# EAGLE design v0.4.4 (EAGLE 7.1.0)
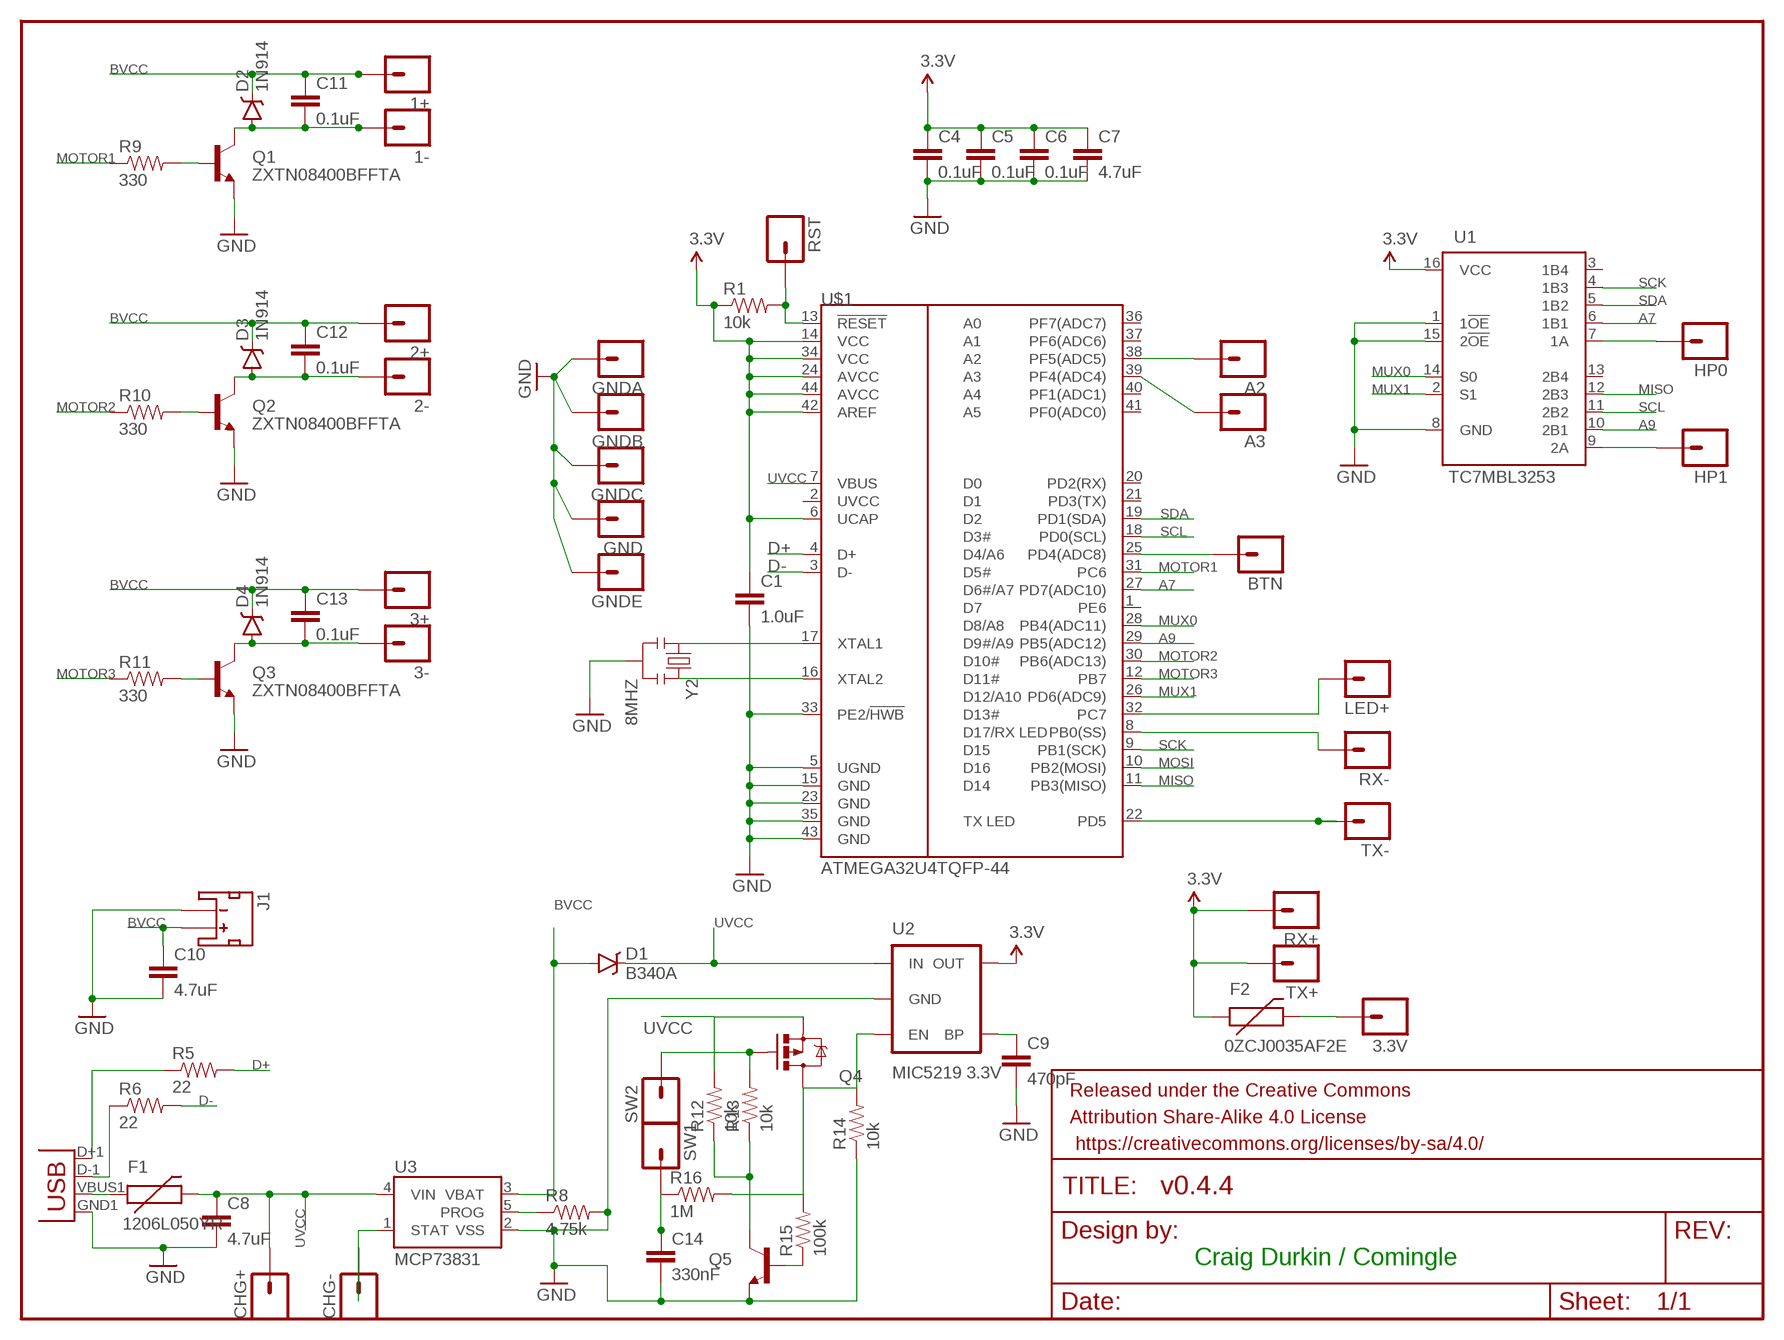
[diagram p0: schematic, sheet 1]

## Parts
1+  M01PTH  [1X01]
1-  M01PTH  [1X01]
2+  M01PTH  [1X01]
2-  M01PTH  [1X01]
3+  M01PTH  [1X01]
3-  M01PTH  [1X01]
3.3V  M01PTH  [1X01]
A2  M01PTH  [1X01]
A3  M01PTH  [1X01]
BTN  M01PTH  [1X01]
C1  1.0uF  CAP0603-CAP  [0603-CAP]
C4  0.1uF  CAP0603-CAP  [0603-CAP]
C5  0.1uF  CAP0603-CAP  [0603-CAP]
C6  0.1uF  CAP0603-CAP  [0603-CAP]
C7  4.7uF  CAP0603-CAP  [0603-CAP]
C8  4.7uF  CAP1206  [1206]
C9  470pF  CAP0603-CAP  [0603-CAP]
C10  4.7uF  CAP1206  [1206]
C11  0.1uF  CAP0603-CAP  [0603-CAP]
C12  0.1uF  CAP0603-CAP  [0603-CAP]
C13  0.1uF  CAP0603-CAP  [0603-CAP]
C14  330nF  CAP0603-CAP  [0603-CAP]
CHG+  M01PTH  [1X01]
CHG-  M01PTH  [1X01]
D1  B340A  DIODE-SCHOTTKY-B340A  [SMA-DIODE]
D2  1N914  BAT20JFILM  [SOD-323]
D3  1N914  BAT20JFILM  [SOD-323]
D4  1N914  BAT20JFILM  [SOD-323]
F1  1206L050YR  PTCSMD  [PTC-1206]
F2  0ZCJ0035AF2E  PTCSMD  [PTC-1206]
FRAME1  FRAME-LETTER  [CREATIVE_COMMONS]
GND  M01PTH  [1X01]
GNDA  M01PTH  [1X01]
GNDB  M01PTH  [1X01]
GNDC  M01PTH  [1X01]
GNDE  M01PTH  [1X01]
HP0  M01PTH  [1X01]
HP1  M01PTH  [1X01]
J1  JST_2MM_MALE  [JST-2-SMD]
JP4  USB  [USB-B-MICRO-SMD_V03]
LED+  M01PTH  [1X01]
Q1  ZXTN08400BFFTA  TRANSISTOR_NPNSOT23-3  [SOT23-3]
Q2  ZXTN08400BFFTA  TRANSISTOR_NPNSOT23-3  [SOT23-3]
Q3  ZXTN08400BFFTA  TRANSISTOR_NPNSOT23-3  [SOT23-3]
Q4  NTS2101PT1G  MOSFET-PCHANNEL  [SOT23-3]
Q5  MMBT2222A  TRANSISTOR_NPNMMBT2222A  [SOT23-3]
R1  10k  RESISTOR0603-RES  [0603-RES]
R5  22  RESISTOR0603-RES  [0603-RES]
R6  22  RESISTOR0603-RES  [0603-RES]
R8  4.75k  RESISTOR0603-RES  [0603-RES]
R9  330  RESISTOR0603-RES  [0603-RES]
R10  330  RESISTOR0603-RES  [0603-RES]
R11  330  RESISTOR0603-RES  [0603-RES]
R12  10k  RESISTOR0603-RES  [0603-RES]
R13  10k  RESISTOR0603-RES  [0603-RES]
R14  10k  RESISTOR0603-RES  [0603-RES]
R15  100k  RESISTOR0603-RES  [0603-RES]
R16  1M  RESISTOR0603-RES  [0603-RES]
RST  M01PTH  [1X01]
RX+  M01PTH  [1X01]
RX-  M01PTH  [1X01]
SW1  M01PTH  [1X01]
SW2  M01PTH  [1X01]
TX+  M01PTH  [1X01]
TX-  M01PTH  [1X01]
U1  TC7MBL3253  [SSOP16-PRACTICE]
U2  MIC5219 3.3V  V_REG_MIC52193.3V  [SOT23-5]
U3  MCP73831  [SOT23-5]
U$1  ATMEGA32U4TQFP-44  [TQFP44]
Y2  8MHZ  RESONATOR8MHZ  [RESONATOR-SMD]

## Nets
A7: U1.6(1B1) U$1.27(PD7(ADC10))
A9: U1.10(2B1) U$1.29(PB5(ADC12))
BVCC: 1+.1 2+.1 3+.1 C10.1 C11.1 C12.1 C13.1 D1.A D2.C D3.C D4.C J1.2(+) U3.3(VBAT)
D+: R5.2 U$1.4(D+)
D-: R6.2 U$1.3(D-)
GNDD: C1.2 C4.2 C5.2 C6.2 C7.2 C8.2 C9.2 C10.2 C14.2 GND.1 GNDA.1 GNDB.1 GNDC.1 GNDE.1 J1.1(-) JP4.GND1(GND) Q1.2(E) Q2.2(E) Q3.2(E) Q5.2(E) R8.2 R14.1 U1.1(1!OE) U1.8(GND) U1.15(2!OE) U2.2(GND) U3.2(VSS) U$1.5(UGND) U$1.15(GND) U$1.23(GND) U$1.33(PE2/!HWB) U$1.35(GND) U$1.43(GND) Y2.2 ; supply symbol labelled GND
MISO: U1.12(2B3) U$1.11(PB3(MISO))
MOSI: U$1.10(PB2(MOSI))
MOTOR1: R9.1 U$1.31(PC6)
MOTOR2: R10.1 U$1.30(PB6(ADC13))
MOTOR3: R11.1 U$1.12(PB7)
MUX0: U1.14(S0) U$1.28(PB4(ADC11))
MUX1: U1.2(S1) U$1.26(PD6(ADC9))
N$1: U$1.17(XTAL1) Y2.1
N$2: R8.1 U3.5(PROG)
N$3: Q4.3(D) R14.2 R15.2 R16.2 U2.3(EN)
N$4: F1.1 JP4.VBUS1(VBUS)
N$5: 3.3V.1 F2.2
N$6: U$1.16(XTAL2) Y2.3
N$7: LED+.1 U$1.32(PC7)
N$8: RX-.1 U$1.8(PB0(SS))
N$9: TX-.1 U$1.22(PD5)
N$10: JP4.D+1(D+) R5.1
N$11: JP4.D-1(D-) R6.1
N$13: HP1.1 U1.9(2A)
N$14: HP0.1 U1.7(1A)
N$15: A2.1 U$1.38(PF5(ADC5))
N$16: A3.1 U$1.39(PF4(ADC4))
N$17: BTN.1 U$1.25(PD4(ADC8))
N$19: CHG-.1 U3.1(STAT)
N$20: Q5.3(C) R12.1 R13.1
N$21: C14.1 R16.1 SW1.1
N$22: C9.1 U2.4(BP)
N$23: Q4.1(G) R13.2 SW2.1
N$24: 1-.1 C11.2 D2.A Q1.3(C)
N$25: 2-.1 C12.2 D3.A Q2.3(C)
N$26: 3-.1 C13.2 D4.A Q3.3(C)
N$27: Q1.1(B) R9.2
N$28: Q2.1(B) R10.2
N$29: Q3.1(B) R11.2
N$30: Q5.1(B) R15.1
RST: R1.2 RST.1 U$1.13(!RESET)
SCK: U1.4(1B3) U$1.9(PB1(SCK))
SCL: U1.11(2B2) U$1.18(PD0(SCL))
SDA: U1.5(1B2) U$1.19(PD1(SDA))
UVCC: C8.1 CHG+.1 D1.C F1.2 Q4.2(S) R12.2 U2.1(IN) U3.4(VIN) U$1.7(VBUS)
VCC: C1.1 C4.1 C5.1 C6.1 C7.1 F2.1 R1.1 RX+.1 TX+.1 U1.16(VCC) U2.5(OUT) U$1.6(UCAP) U$1.14(VCC) U$1.24(AVCC) U$1.34(VCC) U$1.42(AREF) U$1.44(AVCC) ; supply symbol labelled 3.3V
Unconnected: J1.NC1(PAD1) J1.NC2(PAD2) U1.3(1B4) U1.13(2B4) U$1.1(PE6) U$1.2(UVCC) U$1.20(PD2(RX)) U$1.21(PD3(TX)) U$1.36(PF7(ADC7)) U$1.37(PF6(ADC6)) U$1.40(PF1(ADC1)) U$1.41(PF0(ADC0))

## Notes on the sheet
- Craig Durkin / Comingle

## Library data of the parts
1+ 1- 2+ 2- 3+ 3- 3.3V A2 A3 BTN CHG+ CHG- GND GNDA GNDB GNDC GNDE HP0 HP1 LED+ RST RX+ RX- SW1 SW2 TX+ TX- = SparkFun-Connectors:M01: Header 1 Standard 1-pin 0.1" header. Use with straight break away headers (SKU : PRT-00116), right angle break away headers (PRT-00553), swiss pins (PRT-00743), machine pins (PRT-00117), and female headers (PRT-00115).
C1 C9 C11-C14 = SparkFun-Capacitors:CAP: Capacitor Standard 0603 ceramic capacitor, and 0.1" leaded capacitor.
C4-C8 C10 = SparkFun-Passives:CAP: Capacitor Standard 0603 ceramic capacitor, and 0.1" leaded capacitor.
D1 = SparkFun-DiscreteSemi:DIODE-SCHOTTKY: Schottky diodes in SFE's production catalog BAT20J 1A 23V 0.62Vf RB751 120mA 40V 0.37Vf PMEG4005EJ 0.5A 40V 0.42Vf MBRA140 1A 40V 0.5Vf B340A 3A 40V SMA; PROD_ID: DIO-09886
D2-D4 = SparkFun-DiscreteSemi:BAT20JFILM: 23V, 1A Schottky diode, SOD-323 package; PROD_ID: DIO-11623; VALUE: BAT20JFILM
F1 F2 = SparkFun-PowerIC:PTC: Resettable Fuse PTC Resettable Fuse. Spark Fun Electronics SKU : COM-08357; PROD_ID: RES-11150
FRAME1 = SparkFun-Aesthetics:FRAME-LETTER: Schematic Frame Standard 8.5x11 US Letter frame
J1 = SparkFun-Connectors:JST_2MM_MALE: Mates to single-cell LiPo batteries. CONN-08352; PROD_ID: CONN-08352
JP4 = SparkFun-Connectors:USB: USB Connectors USB-B-PTH is fully proven SKU : PRT-00139/CONN-08278 USB-miniB is fully proven SKU : PRT-00587 USB-A-PCB is untested. USB-A-H is throughly reviewed, but untested. Spark Fun Electronics SKU : PRT-00437 USB-B-SMT is throughly reviewed, but untested. Needs silkscreen touching up. USB-A-S has not been used/tested USB-MB-H has not been used/tested USB-MICROB has been used. CONN-09505
Q1-Q3 Q5 = SparkFun-DiscreteSemi:TRANSISTOR_NPN: Generic NPN BJT MMBT2222A - TRANS-08049 (SOT-23, 1A 40V) MPSA42 - TRANS-09116 (SOT-23, 500mA 300V) MMBT5088LT1G - TRANS-11160 (SOT-23, 50 mA 30V) BC547 - COM-08928 <http://www.sparkfun.com/products/8928> (TO-92 45V 100mA) (1.Collector 2.Base 3.Emitter) 2N3904 - COM-00521 <http://www.sparkfun.com/products/521> (TO-92 40V 200mA) (1.Emitter 2.Base 3.Collector) P2N2222A - COM-12852 <http://www.sparkfun.com/products/12852> (TO-92 40V 600mA) (1.Collector 2.Base 3.Emitter); PROD_ID: TRANS-08049
Q4 = SparkFun-DiscreteSemi:MOSFET-PCHANNEL: Generic PMOSFET IRLML2244 - TRANS-11153 (SOT-23 -20V -4.3A) (1.Gate 2.Source 3.Drain) FQP27P06 - COM-10349 <http://www.sparkfun.com/products/10349> (TO-220 -60V -27A) (1.Gate 2.Source 3.Drain); PROD_ID: TRANS-08285
R1 R5 R6 R8-R16 = SparkFun-Passives:RESISTOR: Resistor Basic schematic elements and footprints for 0603, 1206, and PTH resistors.
U1 = SparkFun-DigitalIC:TC7MBL3253: 74CBT 2 x 4:1 multiplexer. 1OE and 2OE are output enable pins, and S0 and S1 determine which ouptut (xB4, xB3, ...) is connected to the xA
U2 = SparkFun-PowerIC:V_REG_MIC5219: V_REG MIC5219 Standard 3.3V and 5V 500mA LDO voltage regulator in SOT-23 layout. Micrel part MIC5219. BP (by-pass) pin is used to lower output noise with 470pF cap, may be left open.; PROD_ID: VREG-09872
U3 = SparkFun-PowerIC:MCP73831: Miniature single cell, fully integrated Li-Ion, Li-polymer charge management controller http://ww1.microchip.com/downloads/en/DeviceDoc/21984a.pdf IC-09995; PROD_ID: IC-09995
U$1 = SparkFun-DigitalIC:ATMEGA32U4: Atmel 44-pin 8-bit Microcontroller with 32KBytes of ISP Flash and USB Controller
Y2 = SparkFun-FreqCtrl:RESONATOR: Resonator Small SMD resonator. Used, eg, on the Arduino Pro/ Pro Mini boards. 8MHz- XTAL-08895 16MHz- XTAL-08900; PROD_ID: XTAL-08895

## Net classes
0 default: width 0.254 mm, drill 0.051 mm, clearance 0.254 mm

## Board
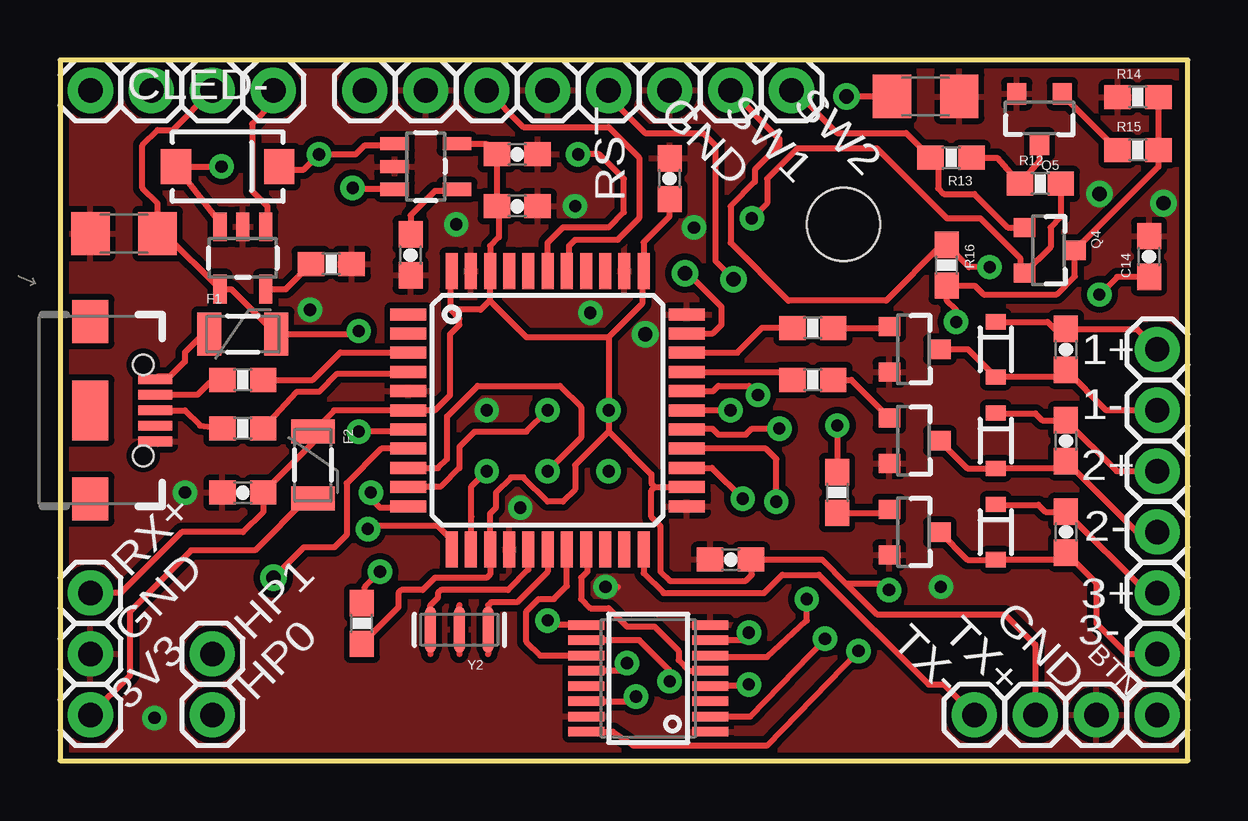
[diagram p1: board, top side]
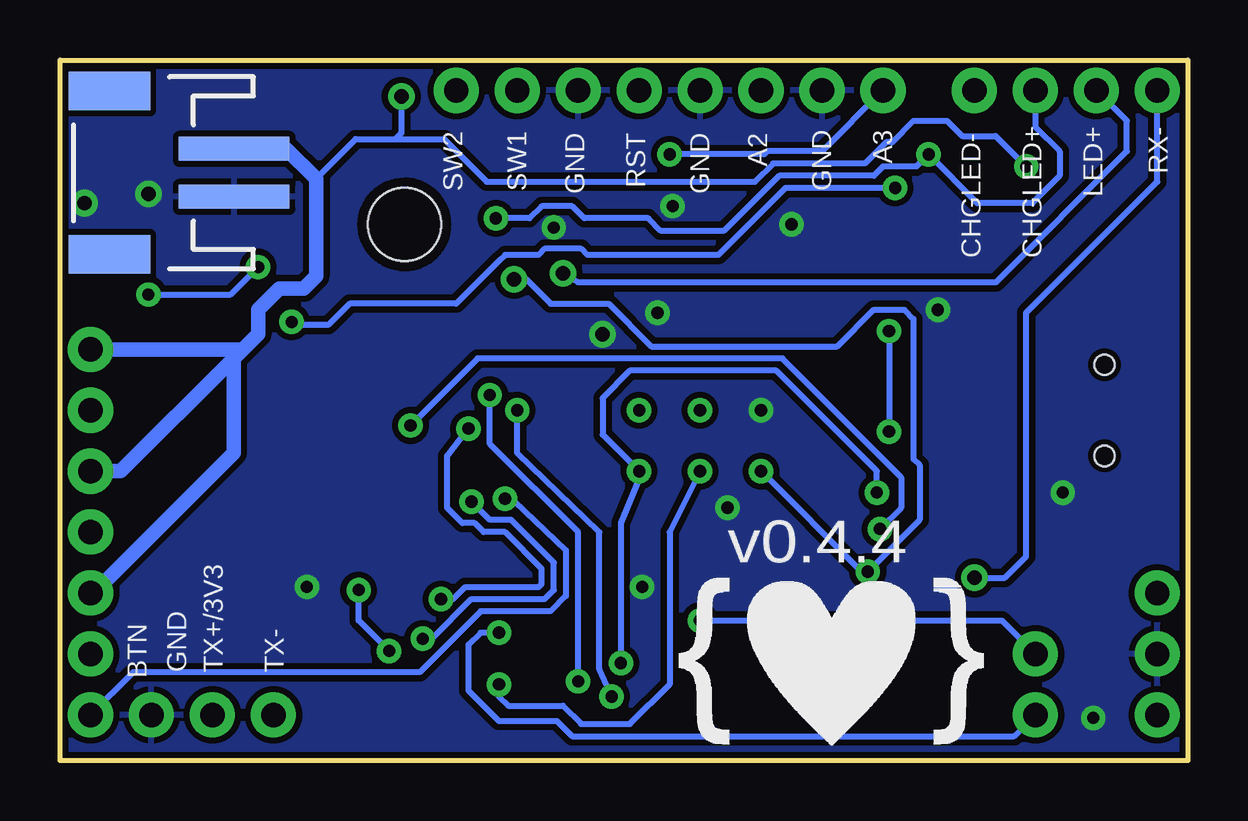
[diagram p2: board, bottom side, seen from below]

Size 46.99 x 29.21 mm. Coordinates in mm from the lower left corner, seen from the top.
Outline: 0,0 46.99,0 46.99,29.21 0,29.21 0,0
Copper layers (1*16): Top 0.035mm / dielectric 1.5mm / Bottom 0.035mm
Design rules "SparkFun *": minimum track width 8mil, minimum drill 20mil, track to track 8mil, track to pad 8mil, pad to pad 8mil, via to via 8mil, smd to smd 8mil, copper to edge 10mil, drill to drill 8mil, minimum pad ring 12mil, minimum via ring 10mil, stop-mask expansion 4mil, vias tented up to drill 19mil, thermal gap 10mil

### Footprints (pad centres in the part's own frame; a part is rotated, then mirrored left to right if it is on the bottom)
1X01 = drill 1.016 pad 1.88: 1 0,0
0603-CAP = smd 1.1 x 1: 1 -0.85,0; 2 0.85,0
1206 = smd 1.6 x 1.8: 1 -1.4,0; 2 1.4,0
SMA-DIODE = smd 1.27 x 1.47: A -2.15,0; C 2.15,0
SOD-323 = smd 0.63 x 0.83: A 1.15,0; C -1.15,0
PTC-1206 = smd 1 x 1.8: 1 -1.4,0; 2 1.4,0
JST-2-SMD = smd 1 x 4.6: 1 -1,-3.7; 2 1,-3.7 | smd 1.6 x 3.4: NC1 -3.4,1.5; NC2 3.4,1.5
USB-B-MICRO-SMD_V03 = smd 1.4 x 0.4: D+1 2.7,0; D-1 2.7,0.65; GND1 2.7,-1.3; ID1 2.7,-0.65; VBUS1 2.7,1.3 | smd 1.5 x 1.8: SHIELD1 0,3.7; SHIELD2 0,-3.7 | smd 1.5 x 2.5: SHIELD3 0,0 | hole 0.85: 2.2,1.9; 2.2,-1.9
SOT23-3 = smd 0.8 x 0.9: 1 -0.95,-1; 2 0.95,-1; 3 0,1.1
0603-RES = smd 1.1 x 1: 1 -0.85,0; 2 0.85,0
SSOP16-PRACTICE = smd 0.4 x 1.5: 1 -2.223,-2.578; 2 -1.587,-2.578; 3 -0.953,-2.578; 4 -0.318,-2.578; 5 0.318,-2.578; 6 0.953,-2.578; 7 1.587,-2.578; 8 2.223,-2.578; 9 2.223,2.578; 10 1.587,2.578; 11 0.953,2.578; 12 0.318,2.578; 13 -0.318,2.578; 14 -0.953,2.578; 15 -1.587,2.578; 16 -2.223,2.578
SOT23-5 = smd 0.55 x 1.2: 1 -0.95,-1.3; 2 0,-1.3; 3 0.95,-1.3; 4 0.95,1.3; 5 -0.95,1.3
TQFP44 = smd 1.5 x 0.5: 1 -5.8,4; 2 -5.8,3.2; 3 -5.8,2.4; 4 -5.8,1.6; 5 -5.8,0.8; 6 -5.8,0; 7 -5.8,-0.8; 8 -5.8,-1.6; 9 -5.8,-2.4; 10 -5.8,-3.2; 11 -5.8,-4; 23 5.8,-4; 24 5.8,-3.2; 25 5.8,-2.4; 26 5.8,-1.6; 27 5.8,-0.8; 28 5.8,0; 29 5.8,0.8; 30 5.8,1.6; 31 5.8,2.4; 32 5.8,3.2; 33 5.8,4 | smd 0.5 x 1.5: 12 -4,-5.8; 13 -3.2,-5.8; 14 -2.4,-5.8; 15 -1.6,-5.8; 16 -0.8,-5.8; 17 0,-5.8; 18 0.8,-5.8; 19 1.6,-5.8; 20 2.4,-5.8; 21 3.2,-5.8; 22 4,-5.8; 34 4,5.8; 35 3.2,5.8; 36 2.4,5.8; 37 1.6,5.8; 38 0.8,5.8; 39 0,5.8; 40 -0.8,5.8; 41 -1.6,5.8; 42 -2.4,5.8; 43 -3.2,5.8; 44 -4,5.8
STAND-OFF-TIGHT = hole 3.048: 0,0
RESONATOR-SMD = smd 0.45 x 1.905: 1 -1.2,0; 2 0,0; 3 1.2,0

### Placement (x,y rotation side)
1+  45.72,17.14 0 top
1-  45.72,14.61 0 top
2+  45.72,12.06 0 top
2-  45.72,9.53 0 top
3+  45.72,6.99 0 top
3-  45.72,4.45 0 top
3.3V  1.27,1.91 0 top
A2  17.78,27.94 0 top
A3  12.7,27.94 0 top
BTN  45.72,1.91 0 top
C1  7.62,11.18 180 top
C4  27.94,8.38 180 top
C5  19.05,23.11 0 top
C6  25.4,24.26 90 top
C7  19.05,25.27 0 top
C8  2.67,21.97 180 top
C9  14.61,21.08 270 top
C10  36.07,27.69 0 top
C11  41.91,17.14 270 top
C12  41.91,13.34 270 top
C13  41.91,9.53 270 top
C14  45.38,21.02 90 top
CHG+  6.35,27.94 0 top
CHG-  8.89,27.94 0 top
D1  6.99,24.77 0 top
D2  38.99,17.14 270 top
D3  38.99,13.34 270 top
D4  38.99,9.53 270 top
F1  7.62,17.78 0 top
F2  10.54,12.32 270 top
FRAME1  5.08,-10.16 0 top  (outside the outline)
GND  20.32,27.94 0 top
GNDA  1.27,4.45 0 top
GNDB  43.18,1.91 0 top
GNDC  25.4,27.94 0 top
GNDE  15.24,27.94 0 top
HP0  6.35,1.91 0 top
HP1  6.35,4.45 0 top
J1  43.43,24.51 90 bottom
JP4  1.27,14.61 0 top
LED+  3.81,27.94 0 top
Q1  35.56,17.14 270 top
Q2  35.56,13.34 270 top
Q3  35.56,9.53 270 top
Q4  41.18,21.27 270 top
Q5  40.81,26.8 180 top
R1  12.57,5.71 90 top
R5  7.62,13.84 0 top
R6  7.62,15.88 0 top
R8  11.3,20.7 0 top
R9  31.37,18.03 0 top
R10  31.37,15.88 0 top
R11  32.38,11.18 270 top
R12  40.85,24.05 0 top
R13  37.13,25.14 180 top
R14  44.91,27.66 0 top
R15  44.91,25.46 0 top
R16  36.94,20.65 270 top
RST  22.86,27.94 0 top
RX+  1.27,6.99 0 top
RX-  1.27,27.94 0 top
SW1  27.94,27.94 0 top
SW2  30.48,27.94 0 top
TX+  40.64,1.91 0 top
TX-  38.1,1.91 0 top
U1  24.51,3.43 90 top
U2  15.24,24.77 270 top
U3  7.62,20.95 180 top
U$1  20.32,14.61 0 top
U$2  [STAND-OFF-TIGHT]  32.64,22.35 0 top
Y2  16.64,5.46 180 top

### Tracks (layer width: path | path; a pad name or v marks a point on that pad's centre or on a via)
A7  (via drill 0.51 pad 0.81)
  Top 0.254: U$1.27 26.16,13.84 27.18,13.84 27.43,13.59 28.57,13.59 28.83,13.84 v29.97,13.84 | U1.6 27.15,4.32 29.46,4.32 31.11,5.84 v31.11,6.73
  Bottom 0.254: v31.11,6.73 30.61,6.73 30.1,7.24 27.05,7.24 26.92,7.37 26.92,8 28.45,9.53 29.34,9.53 29.72,9.91 30.23,9.91 30.86,10.54 30.86,12.7 v29.97,13.84
A9  (via drill 0.51)
  Top 0.254: v25.4,3.3 25.36,3.46 25.36,3.79 24.14,5.02 U1.10 | U$1.29 27.22,15.4 27.43,15.62 28.7,15.62 v29.08,15.24
  Bottom 0.254: v25.4,3.3 25.4,9.53 29.08,13.21 v29.08,15.24
BVCC  (via drill 0.51 pad 0.81, 0.6)
  Top 0.254: D2.C 41.15,18.29 41.44,18 C11.1 44.87,18 1+.1 | D3.C 39,14.48 40.64,14.48 40.93,14.19 C12.1 44.03,12.06 2+.1 | D4.C 39,10.67 40.77,10.67 41.06,10.38 C13.1 45.3,6.99 3+.1 | U3.3 6.74,22.32 D1.A v6.73,24.77 | C10.1 v32.77,27.69
  Bottom 0.254: 33.02,25.91 34.67,25.91 36.32,24.26 | 33.02,25.91 30.99,25.91 29.21,24.13 18.03,24.13 17.27,24.89 13.46,24.89 12.57,25.78 12.32,25.78 11.43,26.67 10.03,26.67 9.4,26.04 8,26.04 v6.73,24.77 | v32.77,27.69 32.77,26.16 33.02,25.91
  Bottom 0.61: 39.37,17.14 1+.1 | 2+.1 44.45,12.06 39.81,16.7 | 39.81,16.7 39.37,17.14 | 3+.1 45.59,6.99 39.75,12.83 39.75,16.64 39.81,16.7 | J1.2 37.58,25.51 36.32,24.26 36.32,20.19 36.83,19.68 37.85,19.68 38.73,18.8 38.73,17.78 39.37,17.14
D+
  Top 0.254: U$1.4 14.44,16.13 11.56,16.13 10.79,15.37 9.87,15.37 R5.2
D-
  Top 0.254: R6.2 10.54,15.88 11.68,17.02 14.51,17.02 U$1.3
GNDD  (via drill 0.51 pad 0.81, 0.6 pad 1.02)
  Top 0.254: 23.24,7.24 v22.73,7.24
  other vias: 22.1,18.67 5.21,11.18 19.18,10.54 36.7,7.24 3.94,1.78 21.46,23.11 17.78,14.61 16.51,22.35 43.31,23.62 45.97,23.24 24.38,17.78 10.41,18.8 26.42,22.23
  pour Top: 0,0 0,29.21 46.99,29.21 46.99,0
  pour Bottom: 0,0 0,29.21 46.99,29.21 46.99,0
MISO  (via drill 0.51, 0.51 pad 0.81)
  Top 0.254: U$1.11 14.46,10.54 13.34,10.54 13.08,10.79 13.08,11.05 v12.95,11.18 | v23.62,4.06 23.3,3.75 U1.12
  Bottom 0.254: v23.62,4.06 23.62,9.91 22.73,12.06 v22.86,12.06 24.38,13.59 24.38,15.11 23.24,16.26 17.14,16.26 12.95,12.06 v12.95,11.18
MOSI  (via drill 0.51)
  Top 0.254: U$1.10 14.54,11.43 15.88,11.43 16.64,12.19 16.64,13.08 17.27,13.72 19.43,13.72 v20.32,14.61
MOTOR1
  Top 0.254: U$1.31 28.22,17 29.25,18.03 R9.1
MOTOR2
  Top 0.254: U$1.30 30.19,16.2 R10.1
MOTOR3  (via drill 0.51 pad 0.81)
  Top 0.254: v32.38,13.97 R11.1 | U$1.12 16.32,9.21 15.75,9.78 12.95,9.78 v12.83,9.65
  Bottom 0.254: v32.38,13.97 29.59,16.76 16.89,16.76 11.94,11.81 11.94,10.54 v12.83,9.65
MUX0  (via drill 0.51)
  Top 0.254: v27.94,14.61 U$1.28 | U1.14 23.81,2.48 v24,2.67
  Bottom 0.254: v24,2.67 24.51,3.81 24.51,9.53 27.94,12.83 v27.94,14.61
MUX1  (via drill 0.51 pad 0.81)
  Top 0.254: U$1.26 29.41,13.01 29.84,12.57 v29.84,10.79 | U1.2 28.77,1.84 v31.88,5.08
  Bottom 0.254: v31.88,5.08 31.5,5.08 29.84,6.73 26.8,6.73 26.42,7.11 26.42,8.26 28.19,10.03 29.08,10.03 v29.84,10.79
N$1
  Top 0.254: U$1.17 20.32,7.87 19.05,6.6 17.96,6.6 17.84,6.48
N$2
  Top 0.254: U3.5 9.41,19.66 R8.1
N$3  (via drill 0.51 pad 1.02)
  Top 0.254: U2.3 12.25,23.82 v12.19,23.88 | v37.34,18.29 37.34,18.8 36.96,19.18 36.96,19.79 R16.2 38.11,19.8 38.48,19.43 41.53,19.43 42.29,20.19 Q4.3 45.76,24.75 R15.2 R14.2
  Bottom 0.254: v37.34,18.29 37.21,18.16 35.81,18.16 34.92,19.05 30.48,19.05 28.64,20.89 28.45,21.08 27.05,21.08 26.8,21.34 25.27,21.34 25.02,21.08 19.56,21.08 16.76,23.88 v12.19,23.88
N$4
  Top 0.254: F1.1 5.97,17.78 5.21,17.02 5.21,16.64 4.57,16 4.07,16 JP4.VBUS1
N$5
  Top 0.254: F2.2 10.28,10.92 8.13,8.76 5.46,8.76 2.92,6.22 2.92,3.56 3.3V.1
N$6
  Top 0.254: U$1.16 19.52,7.96 18.67,7.11 15.88,7.11 15.75,6.99 15.75,6.79 15.44,6.48
N$7  (via drill 0.6)
  Top 0.254: U$1.32 27.2,17.8 27.56,18.16 27.56,18.92 26.16,20.32 v26.04,20.32
  Bottom 0.254: LED+.1 2.54,26.67 2.54,25.4 8,19.94 25.4,19.94 v26.04,20.32
N$8  (via drill 0.6)
  Top 0.254: U$1.8 13.39,13.01 11.94,11.56 11.94,9.4 11.43,8.89 10.16,8.89 v8.89,7.62
  Bottom 0.254: v8.89,7.62 7.62,7.62 6.73,8.51 6.73,18.67 1.27,24.13 RX-.1
N$9
  Top 0.254: 38.06,1.94 TX-.1 36.83,3.17 36.2,3.17 31.62,7.75 30.1,7.75 29.34,6.99 25.15,6.99 24.32,7.81 U$1.22
N$10
  Top 0.254: JP4.D+1 5.21,14.61 5.84,13.97 R5.1
N$11
  Top 0.254: JP4.D-1 5.73,15.26 6.22,15.75 6.64,15.75 R6.1
N$13  (via drill 0.51 pad 0.81)
  Top 0.254: U1.9 20.51,5.65 v20.32,5.84
  Bottom 0.254: v20.32,5.84 7.75,5.84 HP1.1
N$14  (via drill 0.51 pad 0.81)
  Top 0.254: v28.7,5.33 28.38,5.02 U1.7
  Bottom 0.254: v28.7,5.33 29.46,5.33 29.97,4.83 29.97,2.92 28.7,1.65 26.29,1.65 25.65,1.02 7.24,1.02 HP0.1 6.86,1.4
N$15
  Top 0.254: U$1.38 21.21,20.49 21.21,21.46 21.46,21.72 23.24,21.72 24.13,22.61 24.13,25.15 22.86,26.42 19.3,26.42 A2.1
N$16  (via drill 0.51 pad 0.81)
  Top 0.254: U$1.39 20.32,21.59 20.95,22.23 22.86,22.23 23.5,22.86 23.5,24.26 22.48,25.27 v21.59,25.27
  Bottom 0.254: A3.1 15.24,25.4 17.53,25.4 17.65,25.27 v21.59,25.27
N$17  (via drill 0.51 pad 0.81)
  Top 0.254: U$1.25 27.16,12.21 v28.45,10.92
  Bottom 0.254: v28.45,10.92 28.07,10.79 25.91,8.76 25.91,6.86 26.54,6.22 29.46,6.22 32,3.68 43.94,3.68 BTN.1
N$19
  Top 0.254: U3.1 8.64,22.32 8.64,23.11 8,23.75 8,26.54 8.89,27.43 CHG-.1
N$20
  Top 0.254: R13.1 39.04,25.14 R12.1 40.81,24.99 Q5.3
N$21  (via drill 0.51 pad 1.02)
  Top 0.254: C14.1 44.04,20.17 v43.31,19.43 | v38.73,20.57 37.87,20.57 R16.1 36.74,21.5 34.42,19.18 30.35,19.18 27.94,21.59 27.94,23.11 28.96,24.13 28.96,24.64 29.97,25.65 29.97,25.91 SW1.1
  Bottom 0.254: v43.31,19.43 39.88,19.43 v38.73,20.57
N$22
  Top 0.254: U2.4 16.47,23.75 15.62,23.75 14.61,22.73 C9.1
N$23
  Top 0.254: Q4.1 39.5,22.23 38.1,23.62 36.83,23.62 36.59,23.87 36.59,25.14 R13.2 35.25,26.16 32.38,26.16 30.61,27.94 SW2.1
N$24
  Top 0.254: Q1.3 37.84,17.14 D2.A 41.61,15.99 C11.2 43.6,14.61 1-.1
N$25
  Top 0.254: Q2.3 37.81,12.19 D3.A 41.61,12.19 C12.2 44.87,9.53 2-.1
N$26
  Top 0.254: Q3.3 37.81,8.38 D4.A 41.61,8.38 C13.2 43.18,7.41 43.18,5.71 44.45,4.45 3-.1
N$27
  Top 0.254: R9.2 34.5,18.03 Q1.1
N$28
  Top 0.254: R10.2 32.97,15.88 Q2.1
N$29
  Top 0.254: 34.27,10.47 Q3.1 34.41,10.33 R11.2
N$30
  Top 0.254: Q5.1 41.76,27.76 R15.1
RST  (via drill 0.51, 0.51 pad 0.81, 0.6)
  Top 0.254: U$1.13 17.12,10.13 17.14,10.16 17.14,11.43 v17.78,12.06 | R1.2 12.57,6.86 12.7,6.99 12.7,7.24 v13.34,7.87 | RST.1 22.86,27.69 24.38,26.16 26.8,26.16 27.3,25.65 27.3,20.83 v28.07,20.07
  Bottom 0.254: v17.78,12.06 13.59,7.87 v13.34,7.87 11.18,10.03 11.18,12.32 11.43,12.57 11.43,18.41 11.81,18.8 13.08,18.8 14.61,17.27 22.35,17.27 24.13,19.05 26.54,19.05 27.56,20.07 v28.07,20.07
SCK  (via drill 0.51)
  Top 0.254: U$1.9 14.66,12.06 14.79,12.19 15.75,12.19 16.13,12.57 16.13,14.35 17.4,15.62 20.83,15.62 21.72,14.73 21.72,13.46 v20.32,12.06 | v28.7,3.17 28.64,3.11 U1.4
  Bottom 0.254: v20.32,12.06 21.59,9.53 21.59,3.17 23.24,1.52 25.27,1.52 26.04,2.29 28.32,2.29 28.7,2.67 v28.7,3.17
SCL
  Top 0.254: U$1.18 21.12,7.28 20.57,6.73 19.94,6.73 19.43,6.22 19.43,4.95 20,4.38 U1.11
SDA
  Top 0.254: U$1.19 21.97,8.75 21.97,7.87 21.72,7.62 21.72,6.73 22.1,6.35 22.86,6.35 23.62,5.59 24.77,5.59 25.78,4.57 25.78,4.19 26.23,3.75 U1.5
UVCC  (via drill 0.51, 0.51 pad 1.02)
  Top 0.254: U$1.7 14.61,13.72 v12.45,13.72 | D1.C 9.26,24.64 10.16,24.64 v10.79,25.27 12.32,25.27 12.7,25.65 13.88,25.65 U2.1 | v28.83,22.61 29.46,23.24 29.46,24.26 30.73,25.53 34.04,25.53 36.96,22.61 38.35,22.61 40.01,20.95 40.01,20.5 Q4.2 41.27,21.41 41.27,22.23 41.7,22.65 R12.2 | v12.45,17.91 12.32,17.78 F1.2 7.14,19.66 U3.4 4.35,21.97 C8.1 4.07,23.24 3.43,23.88 3.43,25.65 4.06,26.29 4.7,26.29 CHG+.1
  Bottom 0.254: 12.32,13.72 v12.45,13.72 v12.45,17.91 | CHG+.1 6.35,26.42 5.33,25.4 5.33,24.38 6.48,23.24 8.76,23.24 v10.79,25.27 11.3,24.77 12.7,24.77 13.08,24.38 17.02,24.38 19.3,22.1 21.97,22.1 22.48,22.61 25.15,22.61 25.65,23.11 26.92,23.11 27.43,22.61 v28.83,22.61
VCC  (via drill 0.51, 0.51 pad 0.81)
  Top 0.254: U$1.44 16.26,20.34 16.26,18.8 | 22.86,17.65 24.26,19.05 24.26,20.34 U$1.34 24.32,21.61 25.4,22.69 C6.1 | 22.86,17.65 v22.86,14.61 22.86,13.72 | 24.79,11.4 U$1.24 | 22.86,17.65 19.43,17.65 17.91,19.18 | R1.1 14.1,6.39 14.1,6.99 14.22,7.11 15.11,7.11 15.62,7.62 17.78,7.62 17.92,7.76 U$1.14 17.91,8.82 17.91,10.29 18.16,10.54 18.16,11.18 18.8,11.81 19.3,11.81 20.32,10.79 20.95,10.79 21.46,11.3 21.46,12.32 22.86,13.72 | 22.86,13.72 24.64,11.94 24.64,11.56 24.79,11.4 | 24.79,11.4 24.64,11.25 24.64,10.16 25.02,9.78 25.02,7.87 25.4,7.49 28.57,7.49 28.83,7.75 28.83,8.34 C4.1 31.75,8.38 32.77,7.37 | 32.77,7.37 34.04,6.1 39.37,6.1 40.64,4.83 TX+.1 | U1.16 23.05,1.21 23.88,0.64 29.46,0.64 v33.27,4.57 | v34.54,7.11 34.29,7.37 32.77,7.37 | 17.91,19.18 17.53,18.8 16.26,18.8 | RX+.1 2.54,6.99 5.08,9.53 7.62,9.53 8.47,10.38 C1.1 10.54,13.25 F2.1 11.43,14.61 U$1.6 15.62,14.61 16.26,15.24 16.26,17.78 16.64,18.16 16.64,18.41 16.26,18.8 | U2.5 17.76,25.71 C7.1 C5.1 18.29,23.41 18.29,21.82 17.92,21.45 U$1.42 17.91,20.39 17.91,19.18
  Bottom 0.254: v33.27,4.57 34.54,5.84 v34.54,7.11

### Text on the board
tPlace: CLED- | GND | SW1 | SW2 | RST | 1+ | 1- | 2+ | 2- | RX+ | 3+ | GND | HP1 | 3- | TX- | TX+ | GND | BTN | 3V3 | HP0
bPlace: RX- | A3 | A2 | GND | GND | RST | GND | SW1 | SW2 | LED+ | CHGLED+ | CHGLED- | v0.4.4 | TX- | TX+/3V3 | GND | BTN